# Altium schematic sheet Sound.SchDoc
size A4
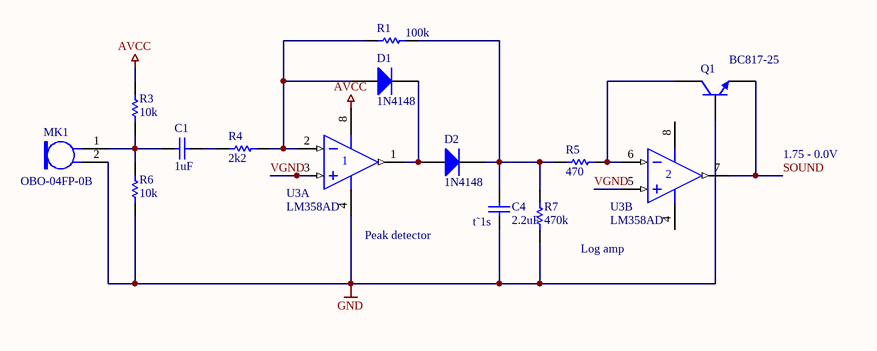
[diagram p0: Sound.SchDoc]

## Parts
C1  value 1uF  [CAPC0805(2012)145_M]  (hidden comment: CAP 1uF 10V 0805(2012))
C4  value 2.2uF  [CAPC0805(2012)145_N]  (hidden comment: CAP 2.2uF 10V 0805(2012))
D1  1N4148  [SOD-323F]
D2  1N4148  [SOD-323F]
MK1  OBO-04FP-0B  [OBO-04FP-0B]
Q1  BC817-25  [SOT23_N]
R1  100k  [6-0805]
R3  10k  [6-0805]
R4  2k2  [6-0805]
R5  470  [6-0805]
R6  10k  [6-0805]
R7  470k  [6-0805]
U3  LM358AD  [SOIC127P600X175-8AN]  (parts A,B of 2)

## Nets
AVCC: R3.2 U3.8(V+)
GND: C4.1 MK1.2 Q1.1(B) R6.1 R7.2 U3.4(V-)
SOUND: Q1.2(E) U3.7(OUT)
VGND: U3.3(IN+) U3.5(IN+)
NetC1_1: C1.1 R4.2
NetC1_2: C1.2 MK1.1 R3.1 R6.2
NetC4_2: C4.2 D2.2(K) R1.1 R5.1 R7.1
NetD1_1: D1.1(A) R1.2 R4.1 U3.2(IN-)
NetD1_2: D1.2(K) D2.1(A) U3.1(OUT)
NetQ1_3: Q1.3(C) R5.2 U3.6(IN-)

## Notes on the sheet
- 1.75 - 0.0V
- Peak detector
- (near C4) t˜1s
- Log amp

## Library data of the parts
C1 = CMP-1036-04740-1: CAP 1uF 10V ±20% 0805 (2012 Metric) Thickness 1.45mm SMD; Case-Metric: 2012; Case-EIA: 0805; Technology: SMT; Rated Voltage: 10 V; Tolerance: ±20%; Max Thickness: 1.45 mm
C4 = CMP-1036-04824-1: CAP 2.2uF 10V ±10% 0805 (2012 Metric) Thickness 1.45mm SMD; Case-Metric: 2012; Case-EIA: 0805; Max Thickness: 1.45 mm; Tolerance: ±10%; Technology: SMT; Rated Voltage: 10 V
D1 D2 = 1N4148: High Conductance Fast Diode; Published: 8-Jun-2000; LatestRevisionDate: 17-Jul-2002; LatestRevisionNote: Re-released for DXP Platform.; DatasheetDocument: 1997; PackageReference: DO-35; Publisher: Altium Limited; Code_JEDEC: DO-204-AH; ComponentLink1Description: Manufacturer Link; ComponentLink1URL: http://www.fairchildsemi.com/; ComponentLink2Description: Datasheet; ComponentLink2URL: http://www.fairchildsemi.com/ds/1N%2F1N4148.pdf
MK1 = Mic2: Microphone; Published: 24-Mar-1999; LatestRevisionDate: 17-Jul-2002; LatestRevisionNote: Re-released for DXP Platform.; PackageReference: PIN2; Publisher: Altium Limited
Q1 = BC817-25: NPN General Purpose Amplifier; Published: 8-Jun-2000; LatestRevisionDate: 20-Nov-2009; LatestRevisionNote: IPC-7351 Footprint Added.; DatasheetVersion: 1997; PackageVersion: Sep-1998; PackageReference: SOT-23A; Publisher: Altium Limited; PackageDescription: 3-Pin SOT-23 Package 0.95 mm Pitch, 2.3 mm Lead Span; ComponentLink1Description: Manufacturer Link; ComponentLink1URL: http://www.fairchildsemi.com/; ComponentLink2Description: Discontinuation Notice; ComponentLink2URL: http://www.fairchildsemi.com/obsolete/obs.jsp
R1 R3-R7 = ERJ6RB: Precision Thick Film Chip Resistor, 10 Ohm to 1M Ohm Range, 1% and 0.5% Tolerance, 0805 Size, 0.1 W; Published: 17-Dec-2003; LatestRevisionDate: 19-Mar-2004; LatestRevisionNote: Silkscreen size reduced.; PackageDocument: Mar-2003; PackageReference: 6-0805; Publisher: Altium Limited; Code_IPC: 2012 [0805]; ComponentLink1Description: Manufacturer Link; ComponentLink1URL: http://www.panasonic.com/industrial/components/resistive_products.htm; ComponentLink2Description: Datasheet; ComponentLink2URL: http://www.panasonic.com/industrial/components/pdf/AOA0000CE2.pdf
U3 = LM358AD: Dual Operational Amplifier; Published: 15-Apr-2002; LatestRevisionDate: 13-Apr-2006; LatestRevisionNote: IPC-7351 Footprint Added.; DatasheetVersion: Aug-1988; PackageVersion: Jan-1998; PackageReference: D008; Publisher: Altium Limited; PackageDescription: 8-Pin Small Outline Integrated Circuit 1.27 mm Pitch; Code_IPC: SOIC127P600-8; ComponentLink1Description: Manufacturer Link; ComponentLink1URL: http://www.ti.com/; ComponentLink2Description: Datasheet; ComponentLink2URL: http://www-s.ti.com/sc/ds/lm358.pdf